# Altium schematic sheet SD.SchDoc
size A4
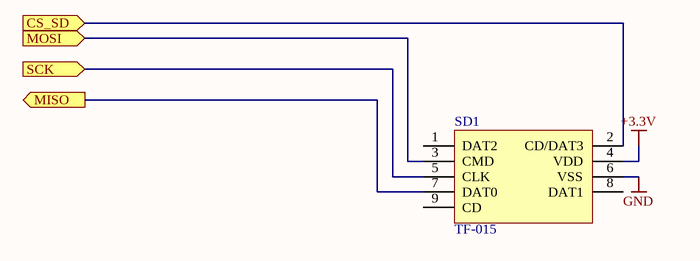
[diagram p0: SD.SchDoc]

## Parts
SD1  TF-015  [TF-015]

## Ports
CS_SD (in), MISO (out), MOSI (in), SCK (in)

## Nets
+3.3V: SD1.4(VDD)
GND: SD1.6(VSS)
CS_SD: SD1.2(CD/DAT3) ; port CS_SD
MISO: SD1.7(DAT0) ; port MISO
MOSI: SD1.3(CMD) ; port MOSI
SCK: SD1.5(CLK) ; port SCK

Not connected (* = marked no-connect by the designer): SD1 1(DAT2) 8(DAT1) 9(CD)

## Library data of the parts
SD1 = TF-015: Connector; Manufacturer_Name: SOFNG; Order: SD-CARD holder as in cansat; Datasheet Link: https://datasheet.lcsc.com/szlcsc/SOFNG-TF-015_C113206.pdf; Height: 1.7mm; Manufacturer_Part_Number: TF-015